# EAGLE design Linefollower_Bluepill (EAGLE 9.3.2)
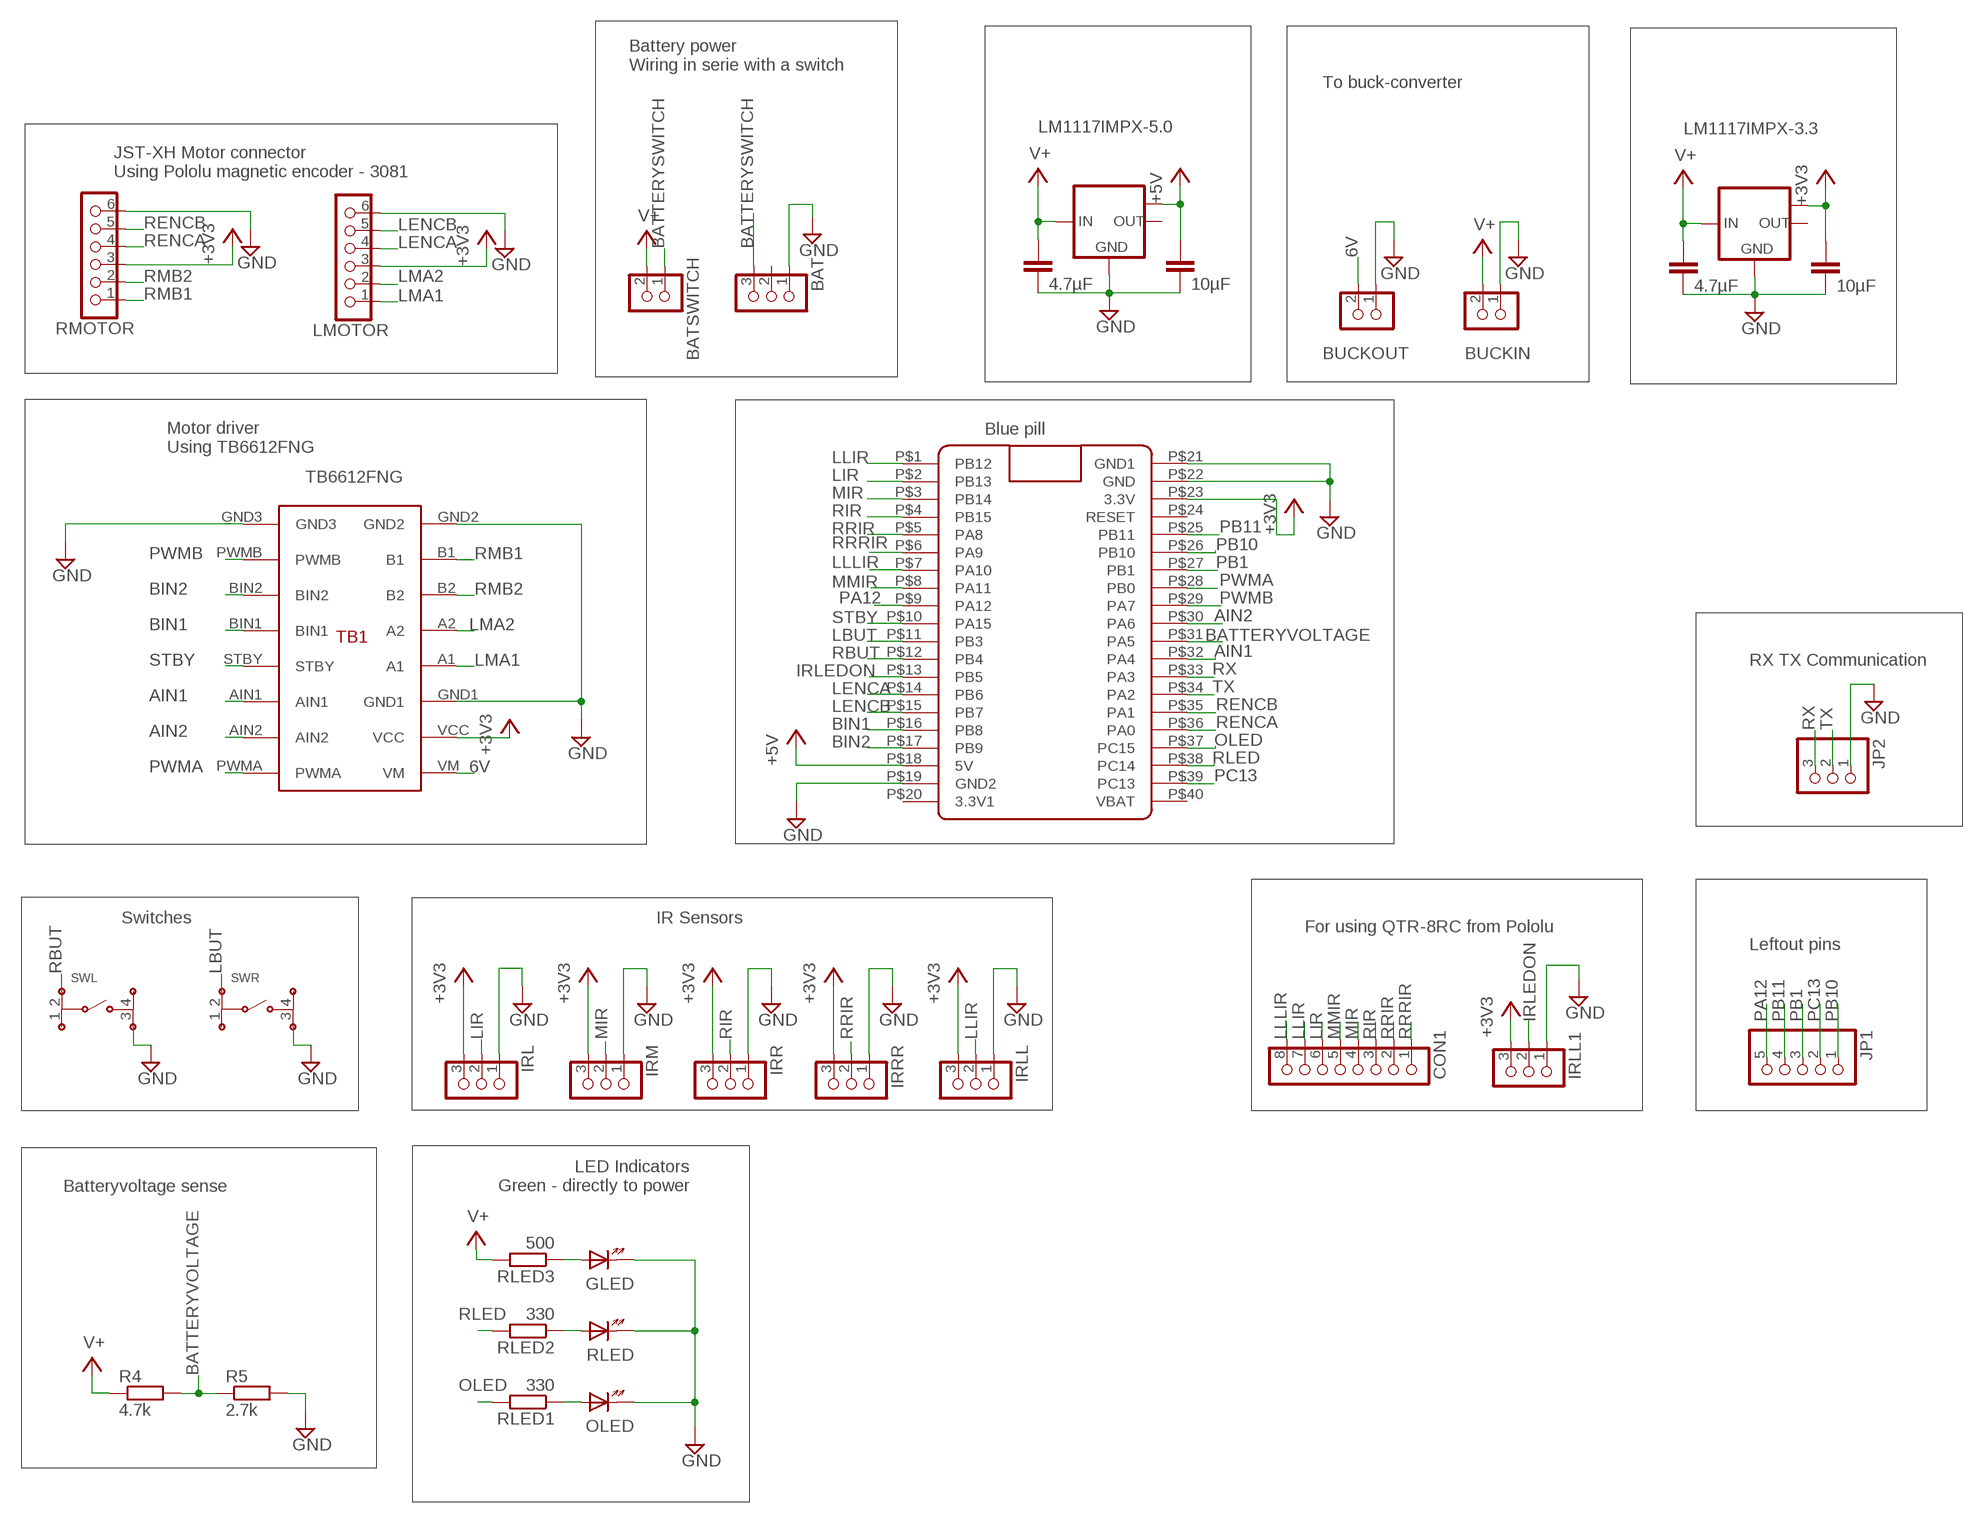
[diagram p0: schematic, sheet 1]

## Parts
BAT  EH_B3B-EH  [B3B-EH]
BATSWITCH  EH_B2B-EH  [B2B-EH]
BUCKIN  EH_B2B-EH  [B2B-EH]
BUCKOUT  EH_B2B-EH  [B2B-EH]
C1  10µF  C0805  [C0805]
C2  4.7µF  C0805  [C0805]
C3  10µF  C0805  [C0805]
C4  4.7µF  C0805  [C0805]
CON1  EH_B8B-EH  [B8B-EH]
GLED  LED5MM  [LED5MM]
IC1  LM1117IMPX-5.0  [SOT223]
IC3  LM1117IMPX-3.3  [SOT223]
IRL  EH_B3B-EH  [B3B-EH]
IRLL  EH_B3B-EH  [B3B-EH]
IRLL1  EH_B3B-EH  [B3B-EH]
IRM  EH_B3B-EH  [B3B-EH]
IRR  EH_B3B-EH  [B3B-EH]
IRRR  EH_B3B-EH  [B3B-EH]
JP1  PINHD-1X5  [1X05]
JP2  PINHD-1X3  [1X03]
LMOTOR  EH_B6B-EH  [B6B-EH]
OLED  LED5MM  [LED5MM]
R4  4.7k  R0603  [R0603]
R5  2.7k  R0603  [R0603]
RLED  LED5MM  [LED5MM]
RLED1  330  R0603  [R0603]
RLED2  330  R0603  [R0603]
RLED3  500  R0603  [R0603]
RMOTOR  EH_B6B-EH  [B6B-EH]
SWL  SKHHA/D  [SKHHA/D]
SWR  SKHHA/D  [SKHHA/D]
TB1  TB6612FNG  [TB6612FNG]
U$1  BLUE_PILL  [BLUE_PILL]

## Nets
6V [motorPower]: BUCKOUT.2 TB1.VM
+3V3 [medium]: C3.1 IC3.TAB(OUT1) IRL.3 IRLL1.3 IRLL.3 IRM.3 IRR.3 IRRR.3 LMOTOR.3 RMOTOR.3 TB1.VCC U$1.P$23(3.3V)
+5V [motorPower]: C1.1 IC1.TAB(OUT1) U$1.P$18(5V)
AIN1: TB1.AIN1 U$1.P$32(PA4)
AIN2: TB1.AIN2 U$1.P$30(PA6)
BATTERYSWITCH [motorPower]: BAT.3 BATSWITCH.1
BATTERYVOLTAGE: R4.2 R5.1 U$1.P$31(PA5)
BIN1: TB1.BIN1 U$1.P$16(PB8)
BIN2: TB1.BIN2 U$1.P$17(PB9)
GND [motorPower]: BAT.1 BUCKIN.1 BUCKOUT.1 C1.2 C2.2 C3.2 C4.2 GLED.K IC1.1(GND) IC3.1(GND) IRL.1 IRLL1.1 IRLL.1 IRM.1 IRR.1 IRRR.1 JP2.1 LMOTOR.6 OLED.K R5.2 RLED.K RMOTOR.6 SWL.3 SWR.3 TB1.GND1 TB1.GND2 TB1.GND3 U$1.P$19(GND2) U$1.P$21(GND1) U$1.P$22(GND)
IRLEDON: IRLL1.2 U$1.P$13(PB5)
LBUT: SWR.2 U$1.P$11(PB3)
LENCA: LMOTOR.4 U$1.P$14(PB6)
LENCB: LMOTOR.5 U$1.P$15(PB7)
LIR: CON1.6 IRL.2 U$1.P$2(PB13)
LLIR: CON1.7 IRLL.2 U$1.P$1(PB12)
LLLIR: CON1.8 U$1.P$7(PA10)
LMA1 [motorPower]: LMOTOR.1 TB1.A1
LMA2: LMOTOR.2 TB1.A2
MIR: CON1.4 IRM.2 U$1.P$3(PB14)
MMIR: CON1.5 U$1.P$8(PA11)
N$1: GLED.A RLED3.1
N$2: RLED2.1 RLED.A
N$3: OLED.A RLED1.1
OLED: RLED1.2 U$1.P$37(PC15)
PA12: JP1.5 U$1.P$9(PA12)
PB1: JP1.3 U$1.P$27(PB1)
PB10: JP1.1 U$1.P$26(PB10)
PB11: JP1.4 U$1.P$25(PB11)
PC13: JP1.2 U$1.P$39(PC13)
PWMA: TB1.PWMA U$1.P$28(PB0)
PWMB: TB1.PWMB U$1.P$29(PA7)
RBUT: SWL.2 U$1.P$12(PB4)
RENCA: RMOTOR.4 U$1.P$36(PA0)
RENCB: RMOTOR.5 U$1.P$35(PA1)
RIR: CON1.3 IRR.2 U$1.P$4(PB15)
RLED: RLED2.2 U$1.P$38(PC14)
RMB1 [motorPower]: RMOTOR.1 TB1.B1
RMB2 [motorPower]: RMOTOR.2 TB1.B2
RRIR: CON1.2 IRRR.2 U$1.P$5(PA8)
RRRIR: CON1.1 U$1.P$6(PA9)
RX: JP2.3 U$1.P$33(PA3)
STBY: TB1.STBY U$1.P$10(PA15)
TX: JP2.2 U$1.P$34(PA2)
V+ [motorPower]: BATSWITCH.2 BUCKIN.2 C2.1 C4.1 IC1.3(IN) IC3.3(IN) R4.1 RLED3.2
Unconnected: BAT.2 IC1.2(OUT) IC3.2(OUT) SWL.1 SWL.4 SWR.1 SWR.4 U$1.P$20(3.3V1) U$1.P$24(RESET) U$1.P$40(VBAT)

## Notes on the sheet
- Battery power
  Wiring in serie with a switch
- To buck-converter
- JST-XH Motor connector
  Using Pololu magnetic encoder - 3081
- Blue pill
- Motor driver
  Using TB6612FNG
- RX TX Communication
- Switches | IR Sensors
- For using QTR-8RC from Pololu
- Leftout pins
- LED Indicators
  Green - directly to power
- Batteryvoltage sense

## Library data of the parts
BAT IRL IRLL IRLL1 IRM IRR IRRR = CASE-JST:EH_B3B-EH: JST EH Connector, through hole, 3 pin, top entry Description: JST EH connector with 2.5 mm pitch, through hole version, 3 pin, top entry. Links: Datasheet <http://www.jst-mfg.com/product/pdf/eng/eEH.pdf>
BATSWITCH BUCKIN BUCKOUT = CASE-JST:EH_B2B-EH: JST EH Connector, through hole, 2 pin, top entry Description: JST EH connector with 2.5 mm pitch, through hole version, 2 pin, top entry. Links: Datasheet <http://www.jst-mfg.com/product/pdf/eng/eEH.pdf>
C1-C4 = CASE-RCL:C0805: Standard Chip CAPACITOR 0805 (2012 Metric) Description: Standard Chip CAPACITOR 0805 (2012 Metric)
CON1 = CASE-JST:EH_B8B-EH: JST EH Connector, through hole, 8 pin, top entry Description: JST EH connector with 2.5 mm pitch, through hole version, 8 pin, top entry. Links: Datasheet <http://www.jst-mfg.com/product/pdf/eng/eEH.pdf>
GLED OLED RLED = CASE-LED:LED5MM: LED 5mm (TH) Description: Standard 5mm TH LED
IC1 IC3 = lm1117:LM1117IMPX-*
JP1 = CASE-Pinhead:PINHD-1X5: PIN HEADER
JP2 = CASE-Pinhead:PINHD-1X3: PIN HEADER
LMOTOR RMOTOR = CASE-JST:EH_B6B-EH: JST EH Connector, through hole, 6 pin, top entry Description: JST EH connector with 2.5 mm pitch, through hole version, 6 pin, top entry. Links: Datasheet <http://www.jst-mfg.com/product/pdf/eng/eEH.pdf>
R4 R5 RLED1-RLED3 = CASE-RCL:R0603: Standard Chip RESISTOR 0603 (1608 Metric) Description: Standard Chip RESISTOR 0603 (1608 Metric)
SWL SWR = CASE-Switches:SKHHA/D: ALPS SKHHA/D Tactile SPST switches (DIP) Description: ALPS SKHHA/D Tactile SPST switches in DIP package. Links: SKHHAJA010 <http://www.farnell.com/datasheets/1685516.pdf?_ga=2.249631877.2071720333.1546461288-1112771566.1525371275> SKHHARA010 <http://www.farnell.com/datasheets/1685516.pdf?_ga=2.249631877.2071720333.1546461288-1112771566.1525371275> SKHHAPA010 <http://www.farnell.com/datasheets/1582298.pdf?_ga=2.236523650.2071720333.1546461288-1112771566.1525371275> SKHHDUA010 <http://www.farnell.com/datasheets/1582310.pdf?_ga=2.236523650.2071720333.1546461288-1112771566.1525371275>
TB1 = TB6612FNG:TB6612FNG
U$1 = BluePill:BLUE_PILL

## Net classes
0 default: width 0.254 mm
1 motorPower: width 0.889 mm, clearance 0.254 mm
2 medium: width 0.508 mm

## Board
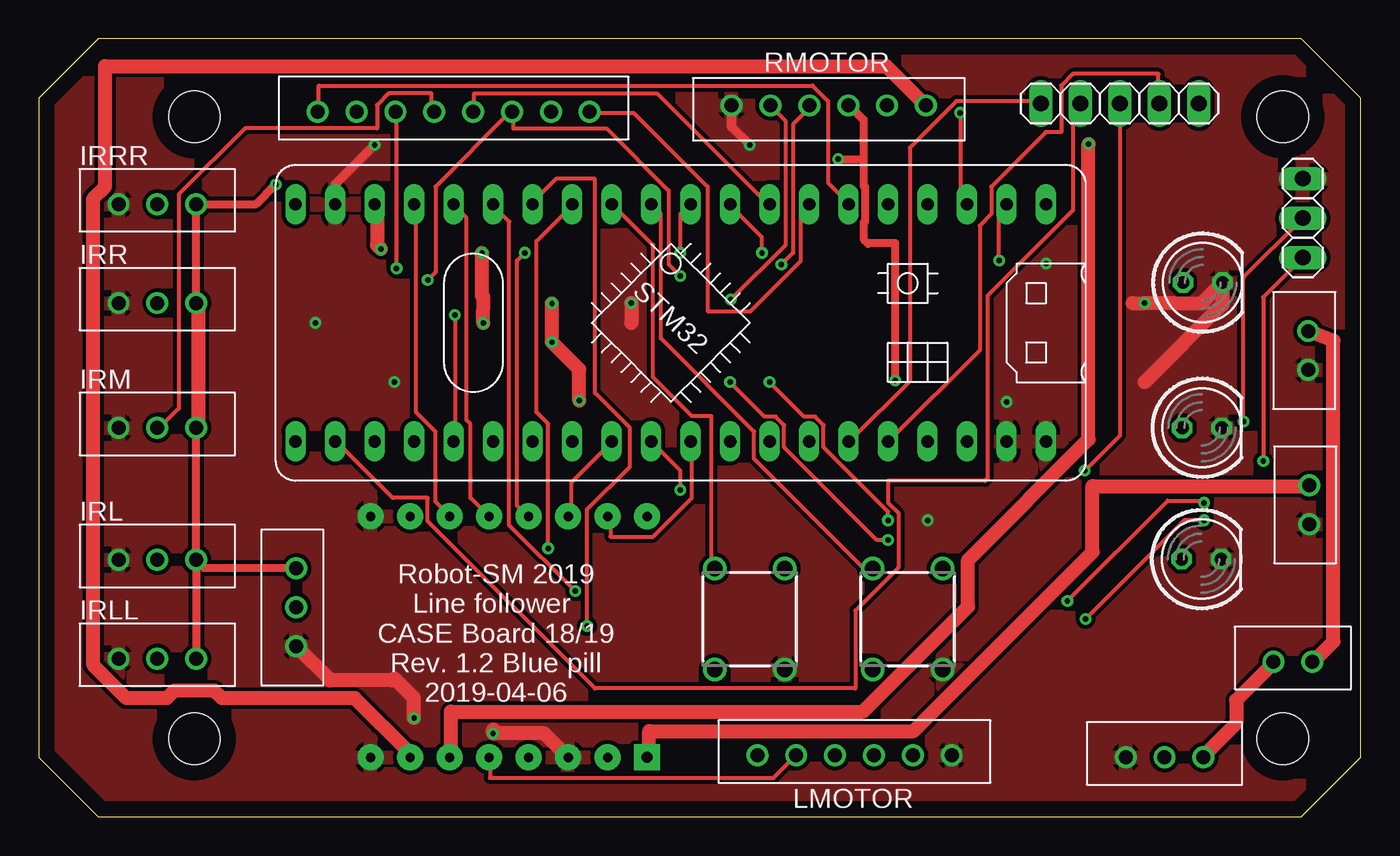
[diagram p1: board, top side]
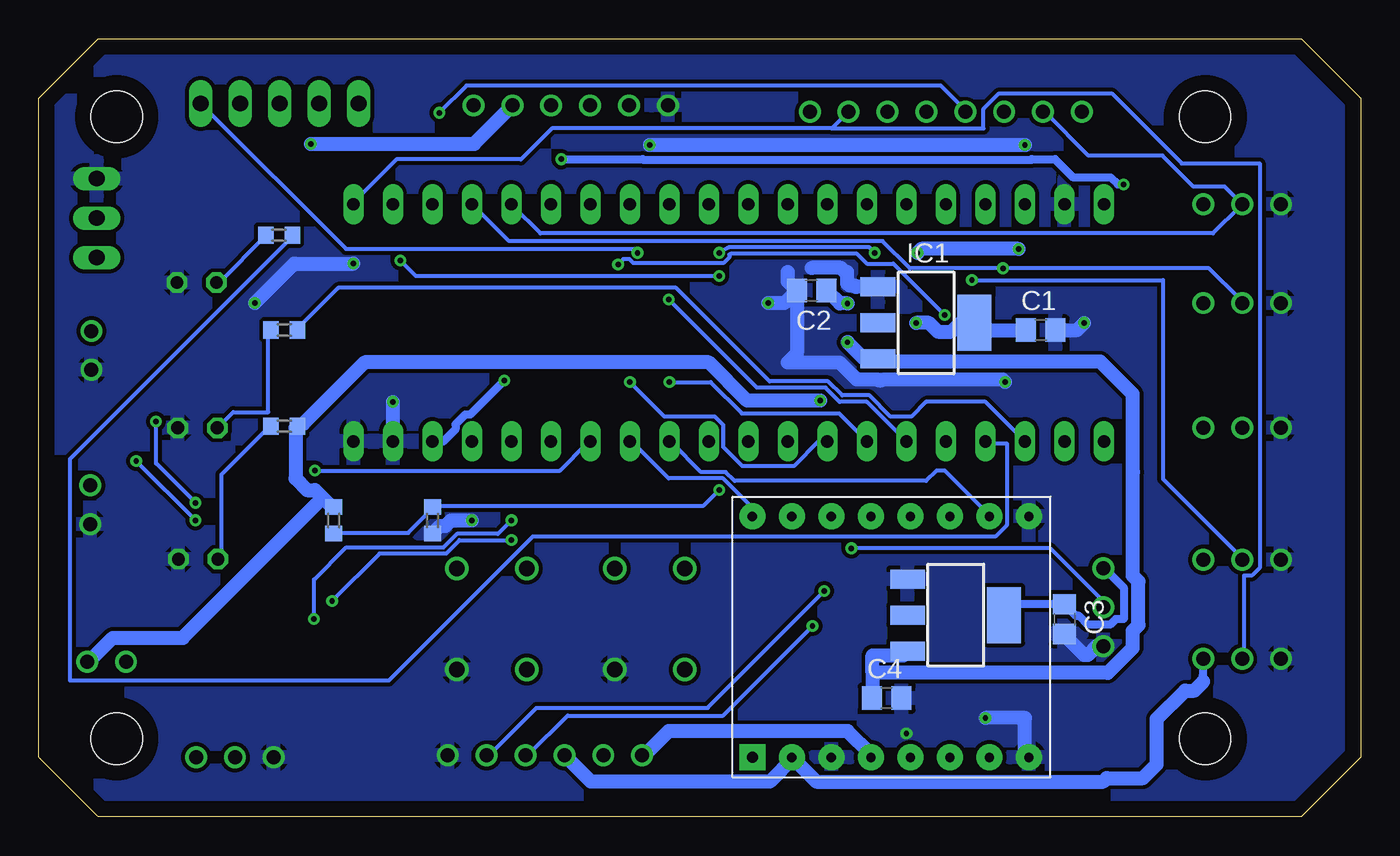
[diagram p2: board, bottom side, seen from below]

Size 85 x 50 mm. Coordinates in mm from the lower left corner, seen from the top.
Outline: 0,46.19 0,3.81 3.81,0 81.19,0 85,3.81 85,46.19 81.19,50 3.81,50 0,46.19
Copper layers (1*16): Top 0.035mm / dielectric 1.5mm / Bottom 0.035mm
Design rules "default": minimum track width 6mil, minimum drill 0.35mm, track to track 6mil, track to pad 6mil, pad to pad 6mil, via to via 6mil, smd to smd 6mil, copper to edge 40mil, drill to drill 6mil, minimum pad ring 10mil, minimum via ring 8mil, stop-mask expansion 4mil, vias tented up to drill 0mil, thermal gap 10mil
Holes 3.3 mm at 10,5 80,5 80,45 10,45

### Footprints (pad centres in the part's own frame; a part is rotated, then mirrored left to right if it is on the bottom)
B3B-EH = drill 0.9: 1 -2.5,0; 2 0,0; 3 2.5,0
B2B-EH = drill 0.9: 1 -1.25,0; 2 1.25,0
C0805 = smd 1.3 x 1.5: 1 -0.95,0; 2 0.95,0
B8B-EH = drill 0.9: 1 -8.75,0; 2 -6.25,0; 3 -3.75,0; 4 -1.25,0; 5 1.25,0; 6 3.75,0; 7 6.25,0; 8 8.75,0
LED5MM = drill 0.813 octagon: A -1.27,0; K 1.27,0
SOT223 = smd 1.219 x 2.235: 1 -2.311,-3.099; 2 0,-3.099; 3 2.311,-3.099 | smd 3.6 x 2.2: TAB 0,3.099
1X05 = drill 1.016 long: 1 -5.08,0; 2 -2.54,0; 3 0,0; 4 2.54,0; 5 5.08,0
1X03 = drill 1.016 long: 1 -2.54,0; 2 0,0; 3 2.54,0
B6B-EH = drill 0.9: 1 -6.25,0; 2 -3.75,0; 3 -1.25,0; 4 1.25,0; 5 3.75,0; 6 6.25,0
R0603 = smd 1 x 1.1: 1 -0.85,0; 2 0.85,0
SKHHA/D = drill 1 pad 1.5: 1 -2.25,-3.25; 2 -2.25,3.25; 3 2.25,-3.25; 4 2.25,3.25
TB6612FNG = drill 0.6 pad 1.676: A1 -7.62,-1.27; A2 -7.62,-3.81; AIN1 7.874,1.27; AIN2 7.874,3.81; B1 -7.62,-8.89; B2 -7.62,-6.35; BIN1 7.874,-3.81; BIN2 7.874,-6.35; GND1 -7.62,1.27; GND2 -7.62,-11.43; GND3 7.874,-11.43; PWMA 7.874,6.35; PWMB 7.874,-8.89; STBY 7.874,-1.27; VCC -7.62,3.81 | drill 0.7 pad 1.676 square: VM -7.62,6.35
BLUE_PILL = drill 0.8 long: P$1 -7.62,15.24; P$2 -7.62,12.7; P$3 -7.62,10.16; P$4 -7.62,7.62; P$5 -7.62,5.08; P$6 -7.62,2.54; P$7 -7.62,0; P$8 -7.62,-2.54; P$9 -7.62,-5.08; P$10 -7.62,-7.62; P$11 -7.62,-10.16; P$12 -7.62,-12.7; P$13 -7.62,-15.24; P$14 -7.62,-17.78; P$15 -7.62,-20.32; P$16 -7.62,-22.86; P$17 -7.62,-25.4; P$18 -7.62,-27.94; P$19 -7.62,-30.48; P$20 -7.62,-33.02; P$21 7.62,15.24; P$22 7.62,12.7; P$23 7.62,10.16; P$24 7.62,7.62; P$25 7.62,5.08; P$26 7.62,2.54; P$27 7.62,0; P$28 7.62,-2.54; P$29 7.62,-5.08; P$30 7.62,-7.62; P$31 7.62,-10.16; P$32 7.62,-12.7; P$33 7.62,-15.24; P$34 7.62,-17.78; P$35 7.62,-20.32; P$36 7.62,-22.86; P$37 7.62,-25.4; P$38 7.62,-27.94; P$39 7.62,-30.48; P$40 7.62,-33.02

### Placement (x,y rotation side)
BAT  72.39,3.81 0 top
BATSWITCH  80.65,9.95 0 top
BUCKIN  81.62,29.97 90 top
BUCKOUT  81.7,20.04 90 top
C1  20.57,31.28 0 bottom
C2  35.31,33.83 180 bottom
C3  19.05,12.7 270 bottom
C4  30.48,7.62 0 bottom
CON1  26.68,45.31 0 top
GLED  74.76,16.55 0 top
IC1  27.94,31.75 270 bottom
IC3  26.04,12.95 270 bottom
IRL  7.62,16.51 0 top
IRLL  7.62,10.16 0 top
IRLL1  16.56,13.46 90 top
IRM  7.62,25 0 top
IRR  7.62,33.02 0 top
IRRR  7.62,39.37 0 top
JP1  69.51,45.84 0 top
JP2  81.28,38.48 270 top
LMOTOR  52.45,3.94 0 top
OLED  74.84,34.33 0 top
R4  66.04,19.05 270 bottom
R5  59.69,19.05 270 bottom
RLED  74.8,25 0 top
RLED1  69.55,37.38 0 bottom
RLED2  69.21,31.29 0 bottom
RLED3  69.21,25.11 0 bottom
RMOTOR  50.8,45.72 180 top
SWL  45.72,12.7 0 top
SWR  55.88,12.7 0 top
TB1  32.77,11.43 90 bottom
U$1  49.53,31.75 270 top

### Tracks (layer width: path | path; a pad name or v marks a point on that pad's centre or on a via)
6V
  Top 0.889: BUCKOUT.2 81.5,21.25 67.75,21.25 67.75,17 56.25,5.5 39.25,5.5 39.25,4 TB1.VM
+3V3  (via drill 0.35)
  Top 0.508: v55.07,28.04 55.07,36.88 53.39,36.88 53.34,36.83 53.03,37.13 53.03,38.18 53.13,38.28 53.13,40.46 53.03,40.56 53.03,42.27 | 53.03,42.27 53.03,44.81 52.12,45.72 RMOTOR.3 | 10.25,25 10.16,24.99 IRM.3 10.25,24.75 10.12,24.62 IRL.3 | v51.41,42.27 53.03,42.27 | IRRR.3 13.97,39.37 v15.24,40.64 | IRR.3 10.12,39.12 10.25,39.25 | IRL.3 IRLL.3 | IRL.3 10.63,16 16.5,16
  Top 0.889: 10.25,39.25 IRRR.3 | 10.25,25 10.25,33 IRR.3 | 16.5,16 IRLL1.3
  Bottom 0.508: 23.16,13.61 22.86,13.61 | 10.12,8.68 10.16,9.04 10.16,10.12 IRLL.3 | IRLL1.3 16.46,15.95 15.24,14.73 15.24,12.7 15.75,12.7 16.1,12.35 17.53,12.35 18.09,12.91 18.31,12.91 C3.1 22.24,13.65 IC3.TAB | v15.24,40.64 15.63,40.64 16.07,41.08 18.47,41.08 19.65,42.27 21.16,42.27 21.2,42.23 46.12,42.23 46.15,42.27 v51.41,42.27 | LMOTOR.3 51.19,3.94 51,3.75 | U$1.P$23 58.98,24.13 58.21,24.9 58.21,25.22 57.59,25.84 57.26,25.84 v55.07,28.04 | 22.82,13.65 22.94,13.54
  Bottom 0.889: 51,3.75 49.5,2.25 38,2.25 36.5,3.75 TB1.VCC 36.25,3.5 35,2.25 16.55,2.25 16.32,2.48 14,2.48 13.11,3.37 13.11,6.29 11.29,8.11 10.69,8.11 10.12,8.68 | IC3.TAB 22.94,13.54 22.86,13.61
+5V  (via drill 0.35)
  Top 0.508: 28.58,33.42 28.5,33.5
  Top 0.889: 28.5,33.5 v28.5,36.25 | v22,36.5 21.75,36.75 21.75,39.25 U$1.P$18 | v28.57,31.75 28.58,33.42
  Bottom 0.889: v28.5,36.25 28.25,36.5 v22,36.5 | C1.1 24.38,31.28 IC1.TAB 25.73,31.75 26.3,31.17 27.2,31.17 27.77,31.75 v28.57,31.75
AIN1
  Top 0.254: U$1.P$32 36.75,24 34.25,21.5 34.25,19.5 TB1.AIN1
AIN2
  Top 0.254: U$1.P$30 42,24 42,20.5 39.5,18 36.75,18 36.75,19.25 TB1.AIN2
BATTERYSWITCH
  Top 0.889: BAT.3 75,4 77,6 77,7.5 79.25,9.75 BATSWITCH.1
BATTERYVOLTAGE  (via drill 0.35)
  Top 0.254: U$1.P$31 41.25,22.25 v41.25,21
  Bottom 0.254: R4.2 66,18.25 61.25,18.25 59.75,19.75 R5.1 59.5,20 42.25,20 v41.25,21
BIN1
  Top 0.254: U$1.P$16 26.75,39.25 27.5,38.5 27.5,25.5 27.75,25.25 27.75,20.5 28.75,19.5 TB1.BIN1
BIN2
  Top 0.254: U$1.P$17 24.25,39.25 24.25,26 25.5,24.75 25.5,20.25 26.25,19.5 TB1.BIN2
GND  (via drill 0.35)
  Top 0.61: RMOTOR.6 44.55,44.35 v45.72,43.18 | v21.59,43.18 19.05,40.64 U$1.P$19
  Top 0.889: v38.1,33.02 38.1,31.75 | 71.12,27.94 76.11,32.94 OLED.K 74.76,32.97 73.01,32.97 72.97,33.02 v71.12,33.02 70.33,33.02 | TB1.GND1 32.5,5.35 v29.21,5.35 29.21,5.61 | IRLL1.1 18.75,8.76 22.73,8.76 22.86,8.89 24.13,7.62 v24.13,6.35
  Bottom 0.889: IC1.1 32.45,34.06 32.53,34.14 32.86,34.14 33.01,34.29 33.01,34.87 33.02,34.88 33.02,35.02 33.16,35.02 33.42,35.27 35.3,35.27 | C2.2 37.06,33.02 v38.1,33.02 | C2.2 36.83,34.4 36.83,35.02 | v45.72,43.18 v21.59,43.18 | C2.2 36.26,29.78 36.83,29.21 33.52,29.21 32.42,28.11 31.09,28.11 30.98,28.03 30.63,28.11 23.03,28.11 v22.86,27.94 | C1.2 18.25,31.28 v17.78,31.75 | U$1.P$22 v62.23,26.67 | v71.12,33.02 68.58,35.56 v64.77,35.56 | R5.2 59.19,18.7 58.85,18.7 58.5,19.05 v57.15,19.05 | IRLL1.1 16.98,10.96 17.55,10.39 17.78,10.39 19.05,11.66 C3.2 | TB1.GND2 21.59,4.06 21.59,6.35 v24.13,6.35
  pour Top: -1.27,52.07 85.09,52.07 91.44,45.72 91.44,1.27 87.63,-2.54 1.27,-2.54 -3.81,2.54 -3.81,49.53
  pour Bottom: -5.08,48.26 -1.27,52.07 86.36,52.07 92.71,45.72 92.71,1.27 87.63,-3.81 86.36,-3.81 78.74,-11.43 7.62,-11.43 -5.08,1.27
IRLEDON  (via drill 0.35)
  Top 0.254: v32.75,17.25 32.75,25.25 32,26 32,37 34.25,39.25 U$1.P$13
  Bottom 0.254: v32.75,17.25 19.97,17.25 16.56,13.84 IRLL1.2
LBUT
  Top 0.254: U$1.P$11 39.5,39.25 40,38.75 40,30.75 46,24.75 46,23 53,16 53.5,16 SWR.2
LENCA  (via drill 0.35)
  Top 0.254: v35.25,12.25 35.25,19.75 38,22.5 38,25 35.75,27.25 35.75,41 33.25,41 31.75,39.5 U$1.P$14
  Bottom 0.254: v35.25,12.25 41,6.5 51,6.5 53.5,4 LMOTOR.4
LENCB  (via drill 0.35)
  Top 0.254: v34.5,14.5 30.25,18.75 30.25,38.25 29.25,39.25 U$1.P$15
  Bottom 0.254: v34.5,14.5 42,7 53,7 56,4 LMOTOR.5
LIR  (via drill 0.35)
  Top 0.254: v61.75,35.75 61.75,39 62,39.25 U$1.P$2 | v41.25,34.75 40.5,35.5 40.5,40.25 36.5,44.25 30.5,44.25 30.5,45.25 CON1.6 30.25,45.25 25.5,40.5 25.5,35 v25,34.5
  Bottom 0.254: v61.75,35.75 60.75,34.75 v41.25,34.75 | v25,34.5 12.71,34.5 12.71,21.71 7.75,16.75 IRL.2
LLIR
  Bottom 0.254: 34,44.25 52,44.25 54,42.25 62,42.25 64.75,39.5 U$1.P$1 | 34,44.25 33,45.25 CON1.7 | 34,44.25 24.25,44.25 24.25,45.5 23.25,46.5 16,46.5 11.5,42 6.5,42 6.5,16 7,15.5 7.5,15.5 7.5,10.25 IRLL.2
LLLIR
  Top 0.254: U$1.P$7 49.5,39.25 49,38.75 49,35.75 45.75,32.5 43,32.5 43,40.5 38.25,45.25 35.5,45.25 CON1.8
LMA1
  Bottom 0.889: LMOTOR.1 46,4 44.5,5.5 33,5.5 31.5,4 TB1.A1
LMA2
  Top 0.254: LMOTOR.2 48.5,3.75 47.25,2.5 29,2.5 29,3.75 TB1.A2
MIR  (via drill 0.35)
  Top 0.254: v59.25,45.25 59.25,39.75 59.5,39.5 U$1.P$3 | IRM.2 7.75,25 9,26.25 9,40 13.25,44.25 21.75,44.25 21.75,45.75 22.5,46.5 25.25,46.5 25.25,45.5 CON1.4
  Bottom 0.254: v59.25,45.25 57.5,47 27,47 25.5,45.5 CON1.4
MMIR
  Top 0.254: U$1.P$8 46.75,39.5 39.75,46.5 28,46.5 28,45.5 CON1.5
N$1
  Bottom 0.254: RLED3.1 70.25,25 73.25,22 73.25,16.75 GLED.A
N$2
  Bottom 0.254: RLED2.1 70.25,31.25 70.25,26 72.5,26 73.5,25 RLED.A
N$3
  Bottom 0.254: RLED1.1 70.5,37.25 73.25,34.5 73.5,34.5 OLED.A
OLED
  Bottom 0.254: RLED1.2 68.75,37.25 83,23 83,8.75 62.5,8.75 53.25,18 23.5,18 22.75,18.75 22.75,24 24,24 U$1.P$37
PA12  (via drill 0.35)
  Top 0.254: v46.5,36.25 46.5,37.25 44.5,39.25 U$1.P$9
  Bottom 0.254: v46.5,36.25 46.75,36.5 65.25,36.5 74.5,45.75 JP1.5
PB1  (via drill 0.35)
  Top 0.254: v67.25,22.25 69.5,24.5 69.5,45.75 JP1.3
  Bottom 0.254: v67.25,22.25 51.5,22.25 49.75,24 U$1.P$27
PB10
  Top 0.254: U$1.P$26 52.25,24.25 56,28 56,43 59,46 64.25,46 JP1.1
PB11
  Top 0.254: U$1.P$25 54.75,24.25 60.5,30 60.5,38 61.25,38.75 61.25,40.5 64.75,44 65.75,44 65.75,47 66.5,47.75 72,47.75 72,46 JP1.4
PC13
  Top 0.254: U$1.P$39 19.25,24 22.75,20.5 25,20.5 25,19 35.75,8.25 52.5,8.25 52.5,13.25 55.27,16.02 55.27,19.53 54.61,20.19 54.61,21.59 60.84,21.59 61,21.75 61,33.5 66.5,39 66.5,45.5 66.75,45.75 JP1.2
PWMA
  Bottom 0.254: U$1.P$28 46.75,24 44.5,21.75 41,21.75 39.25,20 39.25,19.5 TB1.PWMA
PWMB
  Bottom 0.254: U$1.P$29 44.25,24 42.41,22.16 40.83,22.16 40.27,21.59 27.94,21.59 27.28,22.25 26.75,22.25 24,19.5 TB1.PWMB
RBUT
  Top 0.254: U$1.P$12 37,39.25 39.5,36.75 39.5,28.25 42,25.75 43.25,25.75 43.25,16 SWL.2
RENCA  (via drill 0.35)
  Top 0.254: v26.75,32.25 26.75,24.25 U$1.P$36 | v47.75,35.5 48.5,36.25 48.5,44.5 49.5,45.5 RMOTOR.4
  Bottom 0.254: v26.75,32.25 30.06,35.56 31.75,35.56 32.38,36.19 40.53,36.19 40.59,36.13 40.59,35.98 40.98,35.59 46.77,35.59 47.02,35.84 47.41,35.84 v47.75,35.5
RENCB  (via drill 0.35)
  Top 0.254: v44.5,33.25 48,36.75 48,44.75 47.25,45.5 RMOTOR.5
  Bottom 0.254: U$1.P$35 31.75,26.67 33.5,26.67 34.41,27.58 38.83,27.58 v44.5,33.25
RIR  (via drill 0.35)
  Top 0.254: v23,35.25 23,45.25 CON1.3
  Bottom 0.254: U$1.P$4 57,39.25 54.75,37 30.75,37 29,35.25 v23,35.25 9.75,35.25 7.75,33.25 IRR.2
RLED
  Bottom 0.254: RLED2.2 68.25,31.5 65.75,34 44.02,34 38,27.98 34.24,27.98 33.33,27.08 31.58,27.08 30.22,25.72 28.89,25.72 27.94,26.67 24.13,26.67 U$1.P$38
RMB1
  Top 0.889: RMOTOR.1 57,45.75 54.5,48.25 4.25,48.25 4.25,40.5 3.5,39.75 3.5,9.75 5.63,7.62 8.22,7.62 8.71,8.11 11.29,8.11 11.78,7.62 20.32,7.62 23.88,4.06 TB1.B1
RMB2  (via drill 0.35)
  Top 0.889: v67.5,43.25 67.5,24.25 59.75,16.5 59.75,13.5 53,6.75 26.5,6.75 26.5,4 TB1.B2
  Bottom 0.889: v67.5,43.25 57,43.25 54.75,45.5 RMOTOR.2
RRIR
  Bottom 0.254: U$1.P$5 54.5,39.25 52.75,37.5 9.5,37.5 7.75,39.25 IRRR.2 8.75,40.5 10.75,40.5 12.75,42.5 17.5,42.5 20.25,45.25 CON1.2
RRRIR
  Top 0.254: U$1.P$6 52,39.5 50.75,40.75 50.75,46 49.75,47 18,47 18,45.5 CON1.1
RX  (via drill 0.35)
  Top 0.254: v54.61,19.05 54.61,19.62 50.46,23.76 50.46,25.17 49.92,25.72 49.21,25.72 v46.99,27.94 | JP2.3 78.74,33.4 v78.74,22.86 | v74.93,19.05 73.66,19.05 v67.31,12.7
  Bottom 0.254: v46.99,27.94 44.77,25.72 41.52,25.72 40.98,25.17 40.98,23.76 39.76,22.54 36.44,22.54 34.86,24.13 U$1.P$33 | v54.61,19.05 55.47,18.19 58.12,18.19 58.98,17.32 65.23,17.32 67.31,15.24 v67.31,12.7 | v78.74,22.86 v74.93,19.05
STBY  (via drill 0.35)
  Top 0.254: v41.25,36.25 41.25,38.75 41.75,39.25 U$1.P$10 | v31.25,36.25 30.75,35.75 30.75,20 31.25,19.5 TB1.STBY
  Bottom 0.254: v31.25,36.25 31.59,36.59 40.64,36.59 v41.25,36.25
TX  (via drill 0.35)
  Top 0.254: v44.45,27.94 46.67,25.72 47.38,25.72 47.92,25.17 47.92,23.76 53.91,17.78 v54.61,17.78 | v66.14,13.87 72.59,20.32 74.93,20.32 v74.93,20.17 | v77.47,25.4 77.47,34.67 JP2.2
  Bottom 0.254: v54.61,17.78 57.95,17.78 58.81,16.91 63.1,16.91 v66.14,13.87 | v44.45,27.94 41.81,27.94 39.79,25.92 33.54,25.92 U$1.P$34 | v74.93,20.17 77.47,22.71 v77.47,25.4
V+  (via drill 0.35)
  Top 0.889: v33,33 v33,30.5 34.75,28.75 v34.75,26.75 | BUCKIN.2 83.25,30.6 83.25,11.25 82,10 BATSWITCH.2
  Bottom 0.889: v33,33 33.5,33 34.25,33.75 C2.1 | v33,30.5 32,29.5 31.25,29.5 IC1.3 30.75,29.25 16.75,29.25 14.66,27.16 14.66,22.12 | 66.75,20.5 67.25,21 67.75,21 68.5,21.75 68.5,25 RLED3.2 68,25.25 64.04,29.21 41.91,29.21 39.45,26.75 v34.75,26.75 | 66.75,20.5 66.25,20 R4.1 | 66.75,20.5 75.75,11.5 80.25,11.5 81.75,10 BATSWITCH.2 | 31.39,9.25 31.39,10.36 29.41,10.36 IC3.3 | 31.39,9.25 31.39,7.62 C4.1 | 31.39,9.25 16.26,9.25 14.66,10.85 14.66,11.94 14.29,12.3 14.29,15.13 14.66,15.49 14.66,21.59 14.66,22.12 | 14.66,22.12 14.63,22.15

### Text on the board
tNames: RMOTOR | Robot-SM 2019 / Line follower / CASE Board 18/19 / Rev. 1.2 Blue pill / 2019-04-06
tValues: RRIR | LLLIR | Gnd | PB10 | PC13 | PB1 | PB11 | PA12 | GND | TX | RX | Buck in | Gnd | Gnd | 5V | Buck out | 5V | Gnd | Bat switch | Gnd | Gnd | Gnd | Bat In